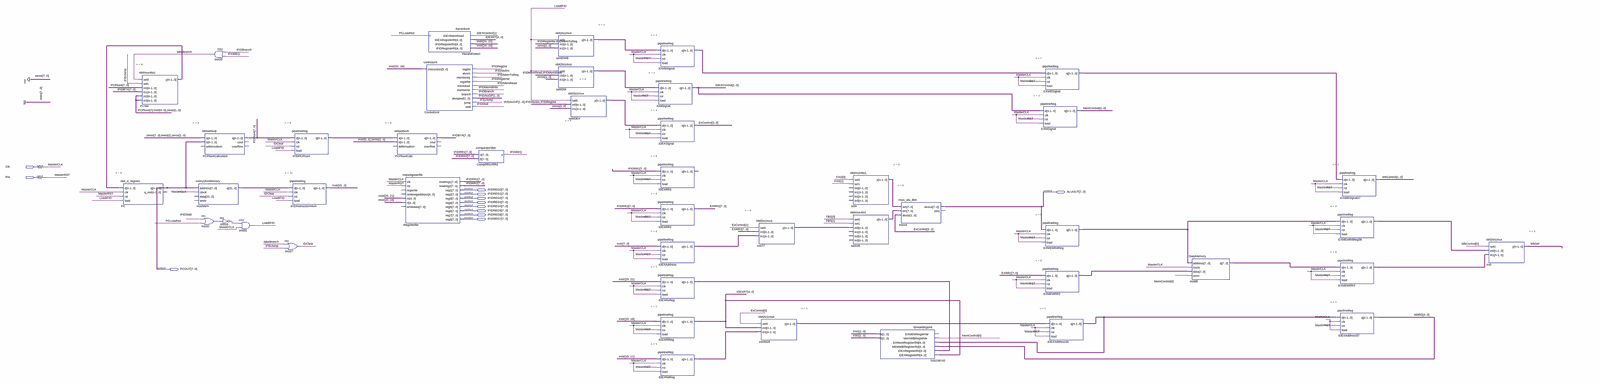
[diagram p0: schematic sheet, whole]
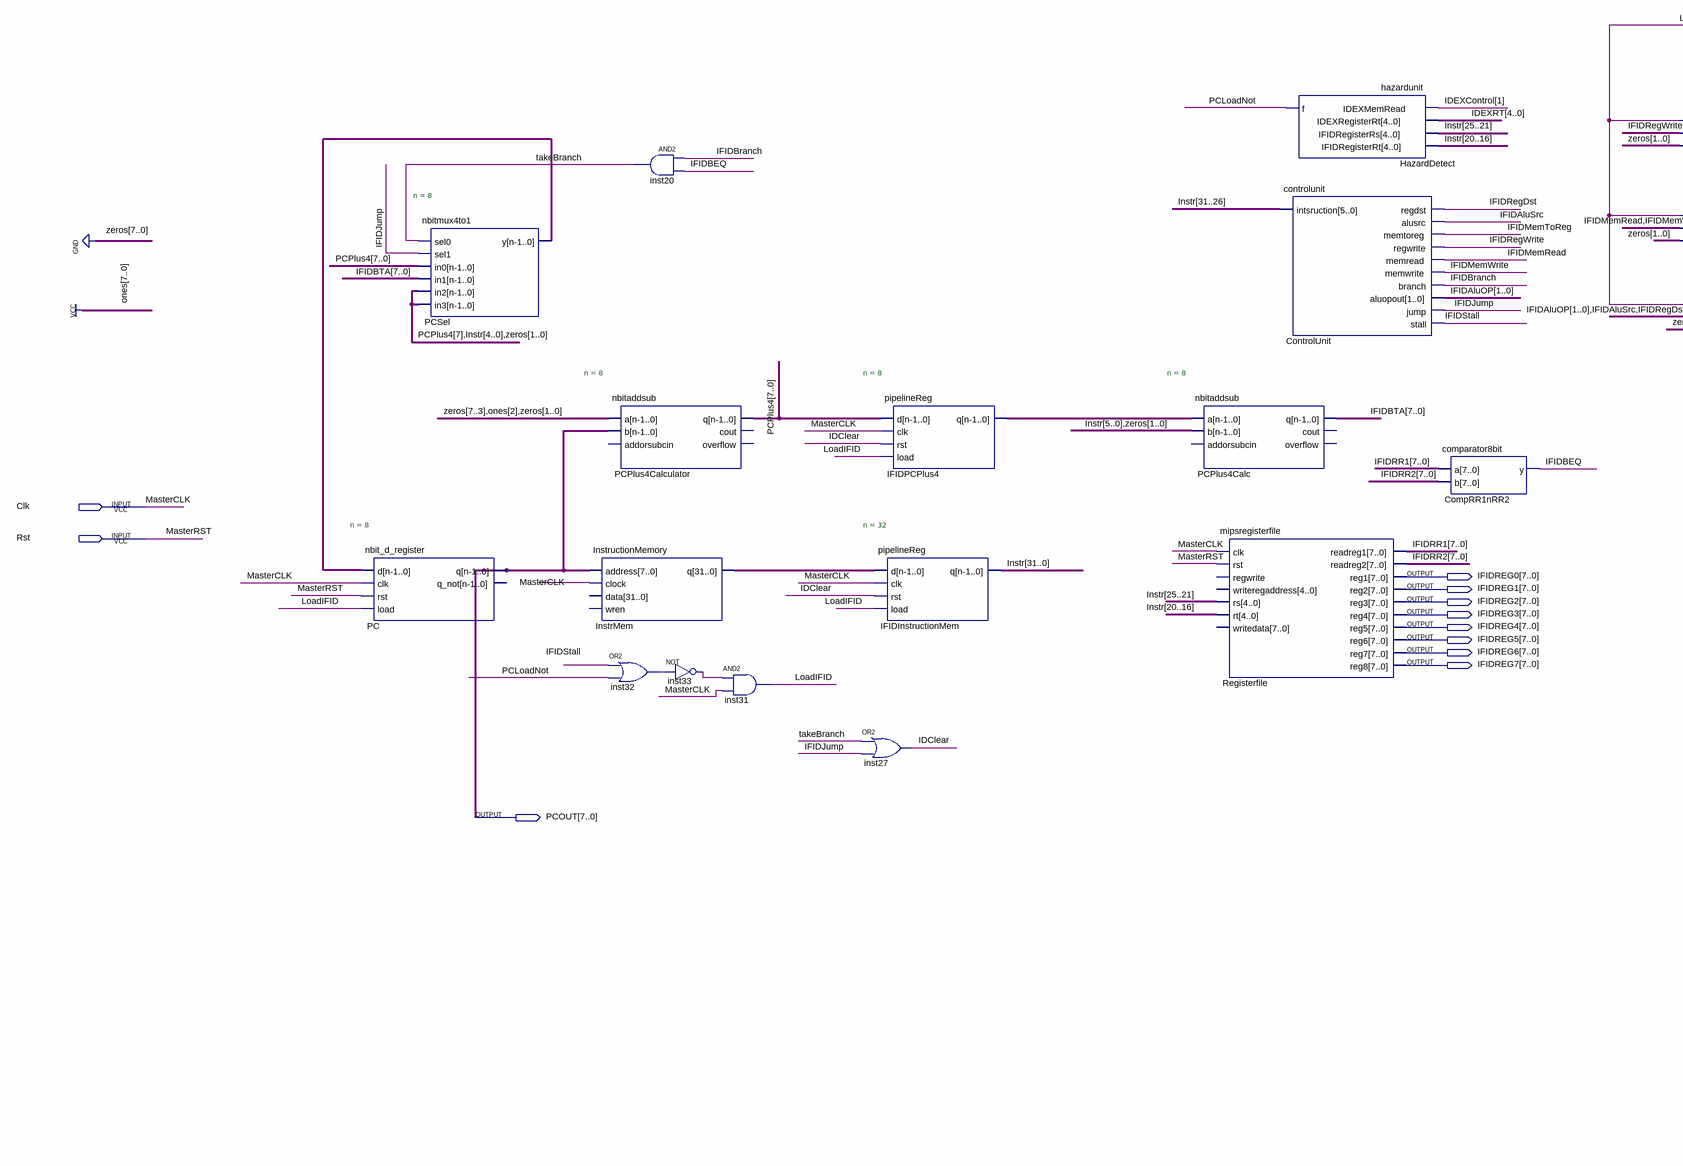
[diagram p1: schematic sheet, left part]
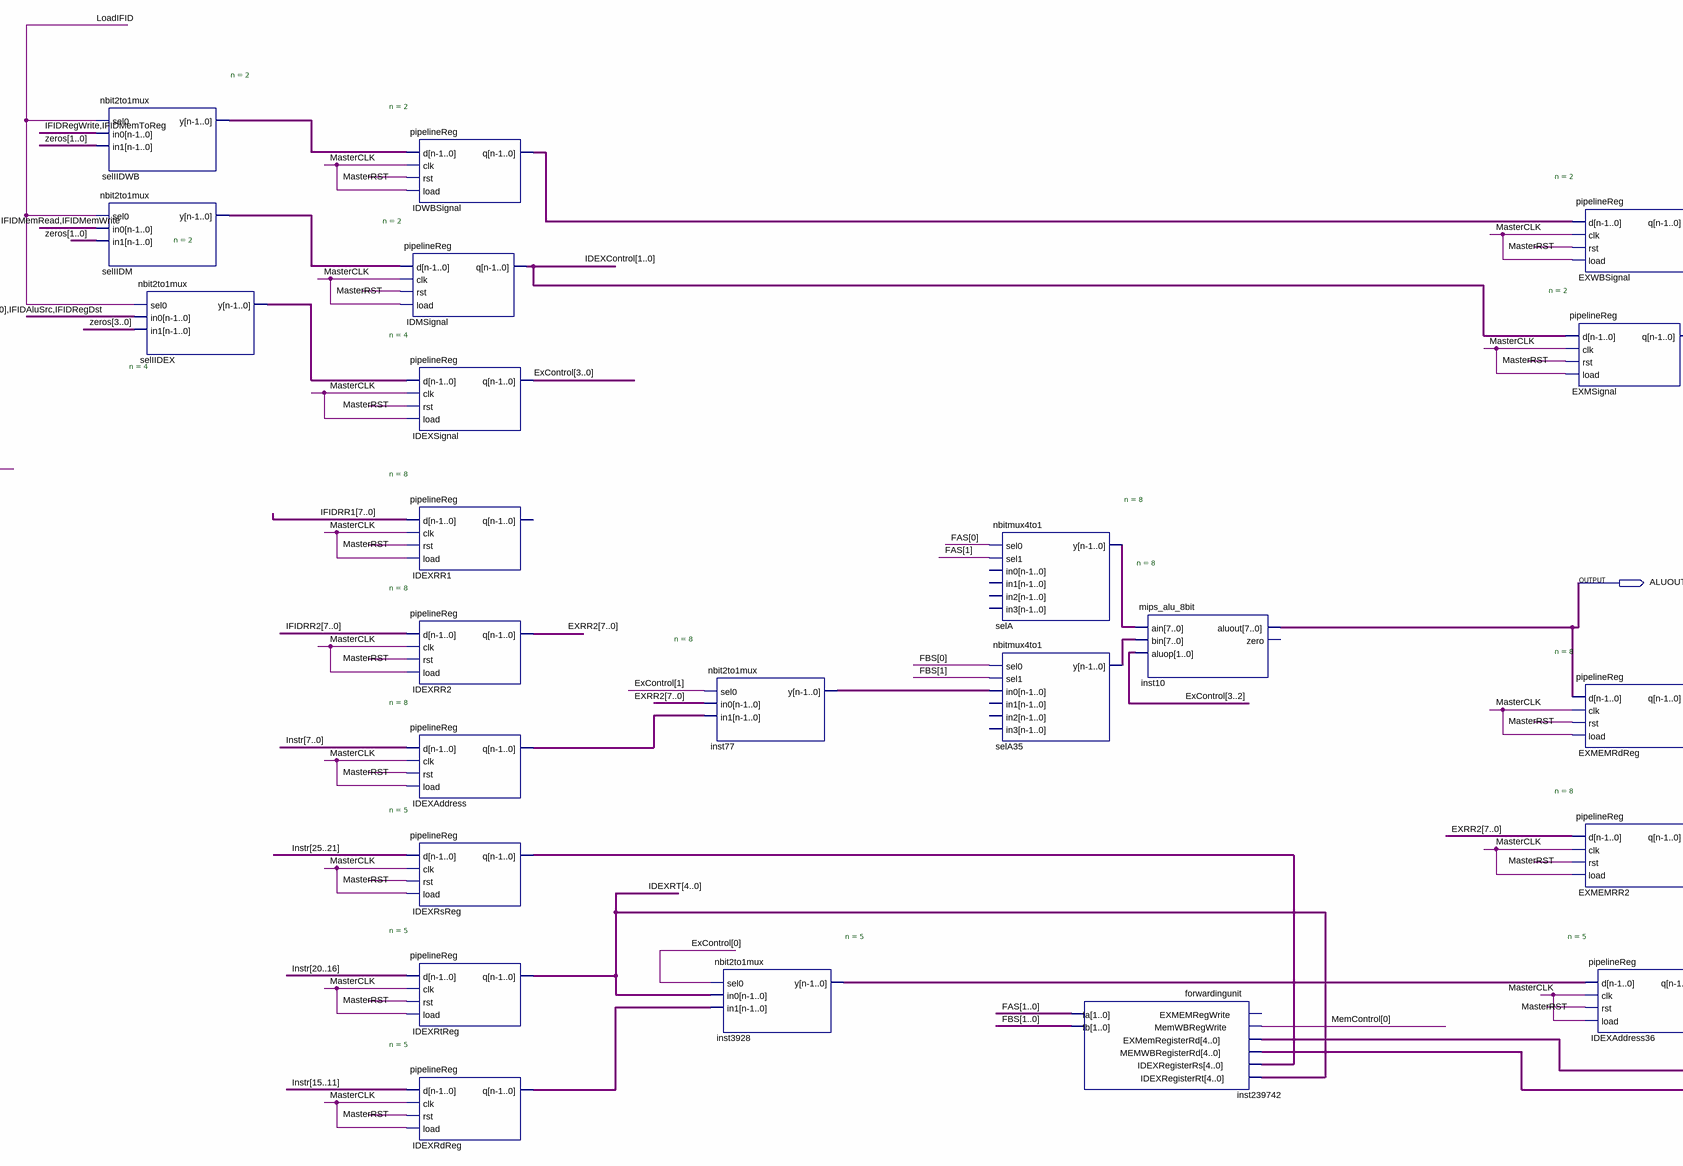
[diagram p2: schematic sheet, centre part]
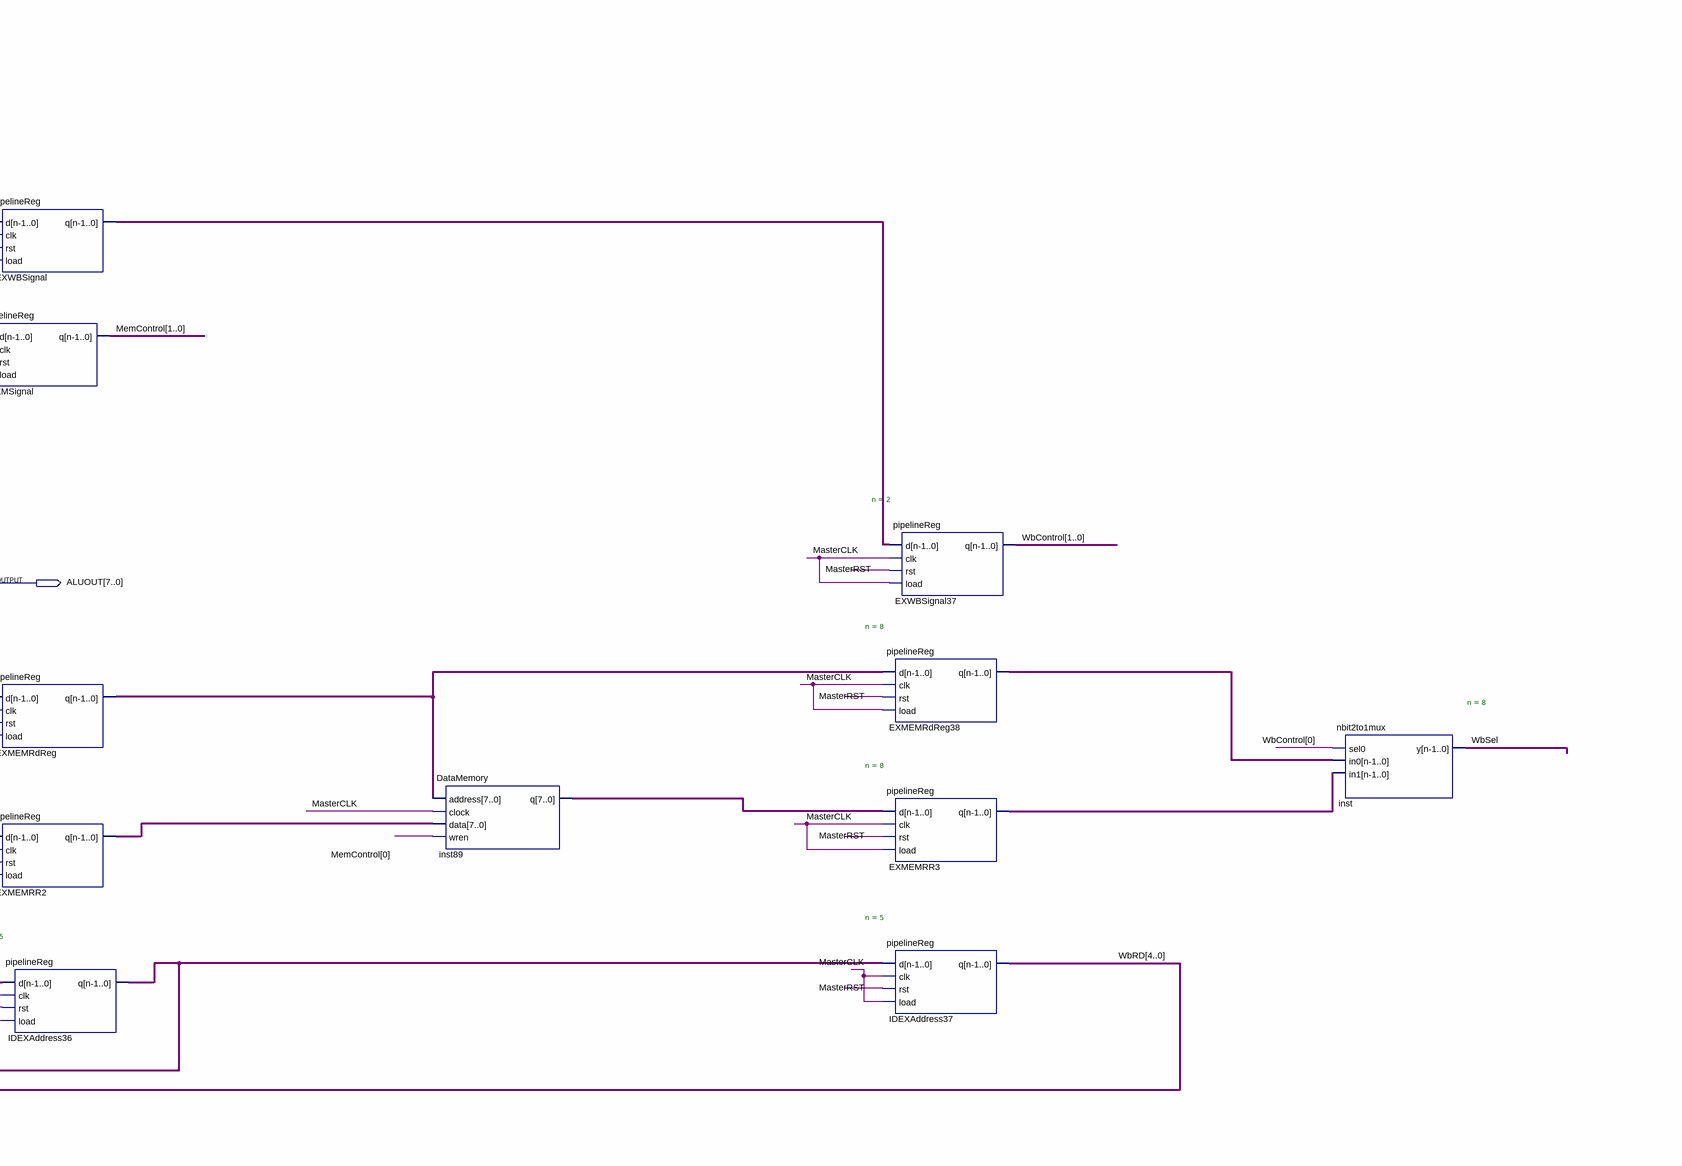
[diagram p3: schematic sheet, right part]
// Quartus schematic TopLevelProcessor.bdf as structural Verilog: 45 symbols, 12 pins
module TopLevelProcessor (
  input  Clk,
  input  Rst,
  output [7:0] IFIDREG0,
  output [7:0] ALUOUT,
  output [7:0] IFIDREG1,
  output [7:0] IFIDREG2,
  output [7:0] IFIDREG3,
  output [7:0] IFIDREG4,
  output [7:0] IFIDREG5,
  output [7:0] IFIDREG6,
  output [7:0] IFIDREG7,
  output [7:0] PCOUT
);

  wire IDClear, IFIDAluSrc, IFIDBEQ, IFIDBranch, IFIDJump, IFIDMemRead, IFIDMemToReg, IFIDMemWrite,
       IFIDRegDst, IFIDRegWrite, IFIDStall, inst32_out, inst33_out, LoadIFID, PCLoadNot, takeBranch, WbSel;
  wire [1:0] EXWBSignal_q, FAS, FBS, IDEXControl, IDWBSignal_q, IFIDAluOP, MemControl, selIIDM_y, selIIDWB_y,
       WbControl;
  wire [3:0] ExControl, selIIDEX_y;
  wire [4:0] IDEXAddress36_q, IDEXRdReg_q, IDEXRsReg_q, IDEXRT, inst3928_y, WbRD;
  wire [7:0] EXMEMRdReg38_q, EXMEMRdReg_q, EXMEMRR2_q, EXMEMRR3_q, EXRR2, IDEXAddress_q, IFIDBTA,
       IFIDPCPlus4_q, IFIDRR1, IFIDRR2, inst77_y, inst89_q, PCPlus4, PCSel_y, selA35_y, selA_y;
  wire [31:0] Instr, InstrMem_q;

  nbit_d_register #(.n(8)) PC (.d(PCSel_y), .clk(Clk), .rst(Rst), .load(LoadIFID), .q(PCOUT));  // open: q_not
  nbitmux4to1 #(.n(8)) PCSel (
    .sel0(takeBranch), .sel1(IFIDJump), .in0(PCPlus4), .in1(IFIDBTA), .in2({PCPlus4[7], Instr[4:0], 2'b00}),
    .in3({PCPlus4[7], Instr[4:0], 2'b00}), .y(PCSel_y));
  nbitaddsub #(.n(8)) PCPlus4Calculator (.a(8'b00000100), .b(PCOUT), .q(PCPlus4));  // open: addorsubcin, cout, overflow
  InstructionMemory InstrMem (.address(PCOUT), .clock(Clk), .q(InstrMem_q));  // open: data, wren
  or inst32 (inst32_out, IFIDStall, PCLoadNot);
  and inst20 (takeBranch, IFIDBranch, IFIDBEQ);
  not inst33 (inst33_out, inst32_out);
  and inst31 (LoadIFID, inst33_out, Clk);
  pipelineReg #(.n(32)) IFIDInstructionMem (.d(InstrMem_q), .clk(Clk), .rst(IDClear), .load(LoadIFID), .q(Instr));
  or inst27 (IDClear, takeBranch, IFIDJump);
  pipelineReg #(.n(8)) IFIDPCPlus4 (.d(PCPlus4), .clk(Clk), .rst(IDClear), .load(LoadIFID), .q(IFIDPCPlus4_q));
  nbitaddsub #(.n(8)) PCPlus4Calc (
    .a(IFIDPCPlus4_q), .b({Instr[5:0], 2'b00}), .q(IFIDBTA));  // open: addorsubcin, cout, overflow
  mipsregisterfile Registerfile (
    .clk(Clk), .rst(Rst), .rs(Instr[25:21]), .rt(Instr[20:16]), .readreg1(IFIDRR1), .readreg2(IFIDRR2),
    .reg1(IFIDREG0), .reg2(IFIDREG1), .reg3(IFIDREG2), .reg4(IFIDREG3), .reg5(IFIDREG4), .reg6(IFIDREG5),
    .reg7(IFIDREG6), .reg8(IFIDREG7));  // open: regwrite, writeregaddress, writedata
  controlunit ControlUnit (
    .intsruction(Instr[31:26]), .regdst(IFIDRegDst), .alusrc(IFIDAluSrc), .memtoreg(IFIDMemToReg),
    .regwrite(IFIDRegWrite), .memread(IFIDMemRead), .memwrite(IFIDMemWrite), .branch(IFIDBranch),
    .aluopout(IFIDAluOP), .jump(IFIDJump), .stall(IFIDStall));
  hazardunit HazardDetect (
    .IDEXMemRead(IDEXControl[1]), .IDEXRegisterRt(IDEXRT), .IFIDRegisterRs(Instr[25:21]),
    .IFIDRegisterRt(Instr[20:16]), .f(PCLoadNot));
  comparator8bit CompRR1nRR2 (.a(IFIDRR1), .b(IFIDRR2), .y(IFIDBEQ));
  nbit2to1mux #(.n(2)) selIIDWB (.sel0(LoadIFID), .in0({IFIDRegWrite, IFIDMemToReg}), .in1(2'b00), .y(selIIDWB_y));
  nbit2to1mux #(.n(2)) selIIDM (.sel0(LoadIFID), .in0({IFIDMemRead, IFIDMemWrite}), .in1(2'b00), .y(selIIDM_y));
  nbit2to1mux #(.n(4)) selIIDEX (
    .sel0(LoadIFID), .in0({IFIDAluOP, IFIDAluSrc, IFIDRegDst}), .in1(4'b0000), .y(selIIDEX_y));
  pipelineReg #(.n(2)) IDWBSignal (.d(selIIDWB_y), .clk(Clk), .rst(Rst), .load(Clk), .q(IDWBSignal_q));
  pipelineReg #(.n(2)) IDMSignal (.d(selIIDM_y), .clk(Clk), .rst(Rst), .load(Clk), .q(IDEXControl));
  pipelineReg #(.n(4)) IDEXSignal (.d(selIIDEX_y), .clk(Clk), .rst(Rst), .load(Clk), .q(ExControl));
  pipelineReg #(.n(8)) IDEXRR1 (.d(IFIDRR1), .clk(Clk), .rst(Rst), .load(Clk));  // open: q
  pipelineReg #(.n(8)) IDEXRR2 (.d(IFIDRR2), .clk(Clk), .rst(Rst), .load(Clk), .q(EXRR2));
  pipelineReg #(.n(8)) IDEXAddress (.d(Instr[7:0]), .clk(Clk), .rst(Rst), .load(Clk), .q(IDEXAddress_q));
  pipelineReg #(.n(5)) IDEXRsReg (.d(Instr[25:21]), .clk(Clk), .rst(Rst), .load(Clk), .q(IDEXRsReg_q));
  pipelineReg #(.n(5)) IDEXRtReg (.d(Instr[20:16]), .clk(Clk), .rst(Rst), .load(Clk), .q(IDEXRT));
  pipelineReg #(.n(5)) IDEXRdReg (.d(Instr[15:11]), .clk(Clk), .rst(Rst), .load(Clk), .q(IDEXRdReg_q));
  nbit2to1mux #(.n(8)) inst77 (.sel0(ExControl[1]), .in0(EXRR2), .in1(IDEXAddress_q), .y(inst77_y));
  nbit2to1mux #(.n(5)) inst3928 (.sel0(ExControl[0]), .in0(IDEXRT), .in1(IDEXRdReg_q), .y(inst3928_y));
  nbitmux4to1 #(.n(8)) selA (.sel0(FAS[0]), .sel1(FAS[1]), .y(selA_y));  // open: in0, in1, in2, in3
  nbitmux4to1 #(.n(8)) selA35 (.sel0(FBS[0]), .sel1(FBS[1]), .in0(inst77_y), .y(selA35_y));  // open: in1, in2, in3
  forwardingunit inst239742 (
    .MemWBRegWrite(MemControl[0]), .EXMemRegisterRd(IDEXAddress36_q), .MEMWBRegisterRd(WbRD),
    .IDEXRegisterRs(IDEXRsReg_q), .IDEXRegisterRt(IDEXRT), .fa(FAS), .fb(FBS));  // open: EXMEMRegWrite
  mips_alu_8bit inst10 (.ain(selA_y), .bin(selA35_y), .aluop(ExControl[3:2]), .aluout(ALUOUT));  // open: zero
  pipelineReg #(.n(2)) EXWBSignal (.d(IDWBSignal_q), .clk(Clk), .rst(Rst), .load(Clk), .q(EXWBSignal_q));
  pipelineReg #(.n(2)) EXMSignal (.d(IDEXControl), .clk(Clk), .rst(Rst), .load(Clk), .q(MemControl));
  pipelineReg #(.n(8)) EXMEMRdReg (.d(ALUOUT), .clk(Clk), .rst(Rst), .load(Clk), .q(EXMEMRdReg_q));
  pipelineReg #(.n(8)) EXMEMRR2 (.d(EXRR2), .clk(Clk), .rst(Rst), .load(Clk), .q(EXMEMRR2_q));
  pipelineReg #(.n(5)) IDEXAddress36 (.d(inst3928_y), .clk(Clk), .rst(Rst), .load(Clk), .q(IDEXAddress36_q));
  DataMemory inst89 (.address(EXMEMRdReg_q), .clock(Clk), .data(EXMEMRR2_q), .wren(MemControl[0]), .q(inst89_q));
  pipelineReg #(.n(2)) EXWBSignal37 (.d(EXWBSignal_q), .clk(Clk), .rst(Rst), .load(Clk), .q(WbControl));
  pipelineReg #(.n(8)) EXMEMRdReg38 (.d(EXMEMRdReg_q), .clk(Clk), .rst(Rst), .load(Clk), .q(EXMEMRdReg38_q));
  pipelineReg #(.n(8)) EXMEMRR3 (.d(inst89_q), .clk(Clk), .rst(Rst), .load(Clk), .q(EXMEMRR3_q));
  pipelineReg #(.n(5)) IDEXAddress37 (.d(IDEXAddress36_q), .clk(Clk), .rst(Rst), .load(Clk), .q(WbRD));
  nbit2to1mux #(.n(8)) inst (.sel0(WbControl[0]), .in0(EXMEMRdReg38_q), .in1(EXMEMRR3_q), .y(WbSel));

  // Other names for the same wires on the sheet: MasterCLK = Clk; MasterRST = Rst
endmodule
